# Altium schematic sheet Outputs.SchDoc
size Letter
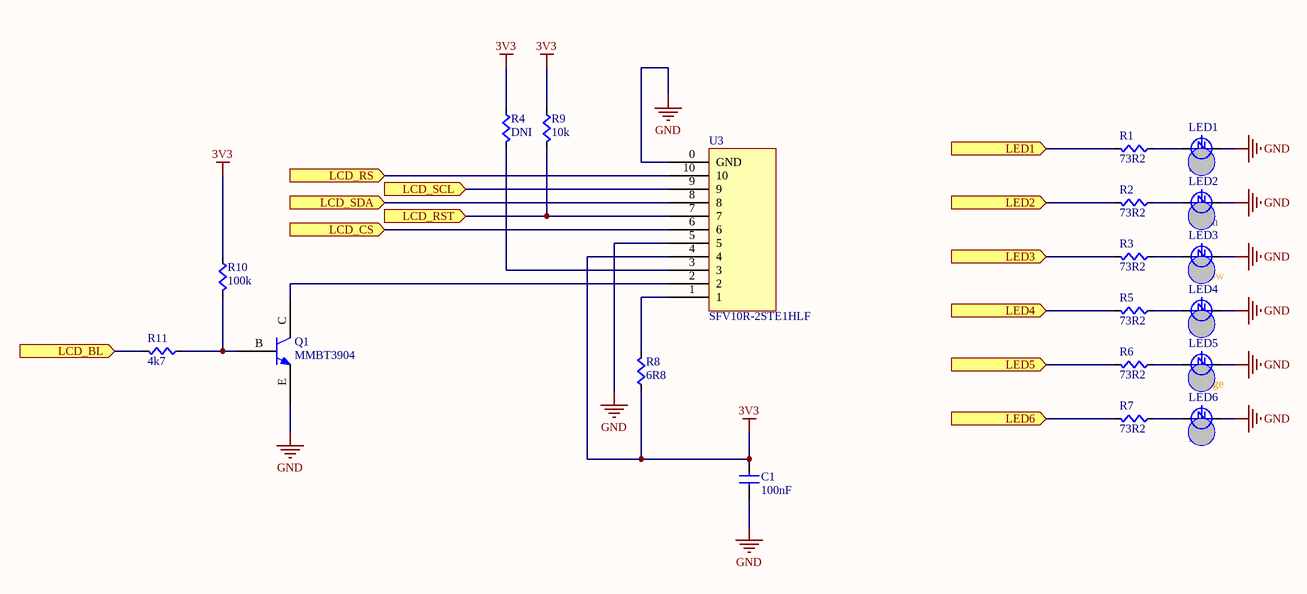
[diagram p0: Outputs.SchDoc]

## Parts
C1  value 100nF  [CAPC0603]  (hidden comment: Cap)
LED1  Color: Red  [LED0603]  (hidden comment: LED)
LED2  Color: Green  [LED0603]  (hidden comment: LED)
LED3  Color: Yellow  [LED0603]  (hidden comment: LED)
LED4  Color: Pink  [LED0603]  (hidden comment: LED)
LED5  Color: Orange  [LED0603]  (hidden comment: LED)
LED6  Color: Blue  [LED0603]  (hidden comment: LED)
Q1  MMBT3904  [MMBT3904]
R1  value 73R2  [RES0603]  (hidden comment: Res)
R2  value 73R2  [RES0603]  (hidden comment: Res)
R3  value 73R2  [RES0603]  (hidden comment: Res)
R4  value DNI  [RES0603]  (hidden comment: Res)
R5  value 73R2  [RES0603]  (hidden comment: Res)
R6  value 73R2  [RES0603]  (hidden comment: Res)
R7  value 73R2  [RES0603]  (hidden comment: Res)
R8  value 6R8  [RES0603]  (hidden comment: Res)
R9  value 10k  [RES0603]  (hidden comment: Res)
R10  value 100k  [RES0603]  (hidden comment: Res)
R11  value 4k7  [RES0603]  (hidden comment: Res)
U3  SFV10R-2STE1HLF  [SFV10R-2STE1HLF]

## Ports
LCD_BL (in), LCD_CS (in), LCD_RS (in), LCD_RST (in), LCD_SCL (in), LCD_SDA (in), LED1 (in), LED2 (in), LED3 (in), LED4 (in), LED5 (in), LED6 (in)

## Nets
3V3: C1.1(A) R4.2(B) R8.2(B) R9.2(B) R10.2(B) U3.4
GND: C1.2(B) LED1.C LED2.C LED3.C LED4.C LED5.C LED6.C Q1.E U3.0(GND) U3.5
LCD_BL: R11.1(A) ; port LCD_BL
LCD_CS: U3.6 ; port LCD_CS
LCD_RS: U3.10 ; port LCD_RS
LCD_RST: R9.1(A) U3.7 ; port LCD_RST
LCD_SCL: U3.9 ; port LCD_SCL
LCD_SDA: U3.8 ; port LCD_SDA
LED1: R1.1(A) ; port LED1
LED2: R2.1(A) ; port LED2
LED3: R3.1(A) ; port LED3
LED4: R5.1(A) ; port LED4
LED5: R6.1(A) ; port LED5
LED6: R7.1(A) ; port LED6
NetLED1_A: LED1.A R1.2(B)
NetLED2_A: LED2.A R2.2(B)
NetLED3_A: LED3.A R3.2(B)
NetLED4_A: LED4.A R5.2(B)
NetLED5_A: LED5.A R6.2(B)
NetLED6_A: LED6.A R7.2(B)
NetQ1_B: Q1.B R10.1(A) R11.2(B)
NetQ1_C: Q1.C U3.2
NetR4_1: R4.1(A) U3.3
NetR8_1: R8.1(A) U3.1

## Library data of the parts
Q1 = MMBT3904: TRANS NPN 40V 0.2A SOT-23; Manufacturer 1: Fairchild Semiconductor; Supplier 1: Digi-Key; Supplier Part Number 1: MMBT3904FSCT-ND; Manufacturer Part Number 1: MMBT3904
U3 = SFV10R-2STE1HLF: CONN FFC TOP 10POS 0.50MM R/A; Manufacturer 1: Amphenol FCI; Manufacturer Part Number 1: SFV10R-2STE1HLF; Supplier Part Number 1: 609-4306-1-ND; Supplier 1: Digi-Key; ComponentLink1URL: https://cdn.amphenol-icc.com/media/wysiwyg/files/drawing/10112793.pdf; ComponentLink1Description: "Datasheet"; ComponentLink2URL: https://www.digikey.com/product-detail/en/amphenol-fci/SFV10R-2STE1HLF/609-4306-1-ND/2626757
C1 = Cap: Supplier 1: Digi-Key; Supplier Part Number 1: 1276-1000-1-ND
LED1-LED6 = LED: Supplier 1: Digi-Key; Supplier Part Number 1: 754-1122-1-ND
R1-R11 = Res: Supplier 1: Digi-Key
  R1-R3 R5-R7: Supplier Part Number 1: RMCF0603FT73R2CT-ND
  R4: Supplier Part Number 1: RMCF0603JT10K0CT-ND
  R8: Supplier Part Number 1: RMCF0603FT6R80CT-ND
  R9: Supplier Part Number 1: RMCF0603FT10K0CT-ND
  R10: Supplier Part Number 1: RMCF0603FG100KCT-ND
  R11: Supplier Part Number 1: RMCF0603FT4K70CT-ND